# Altium schematic sheet MCU.SchDoc
size A3; SheetNumber: 2; SheetTotal: 6
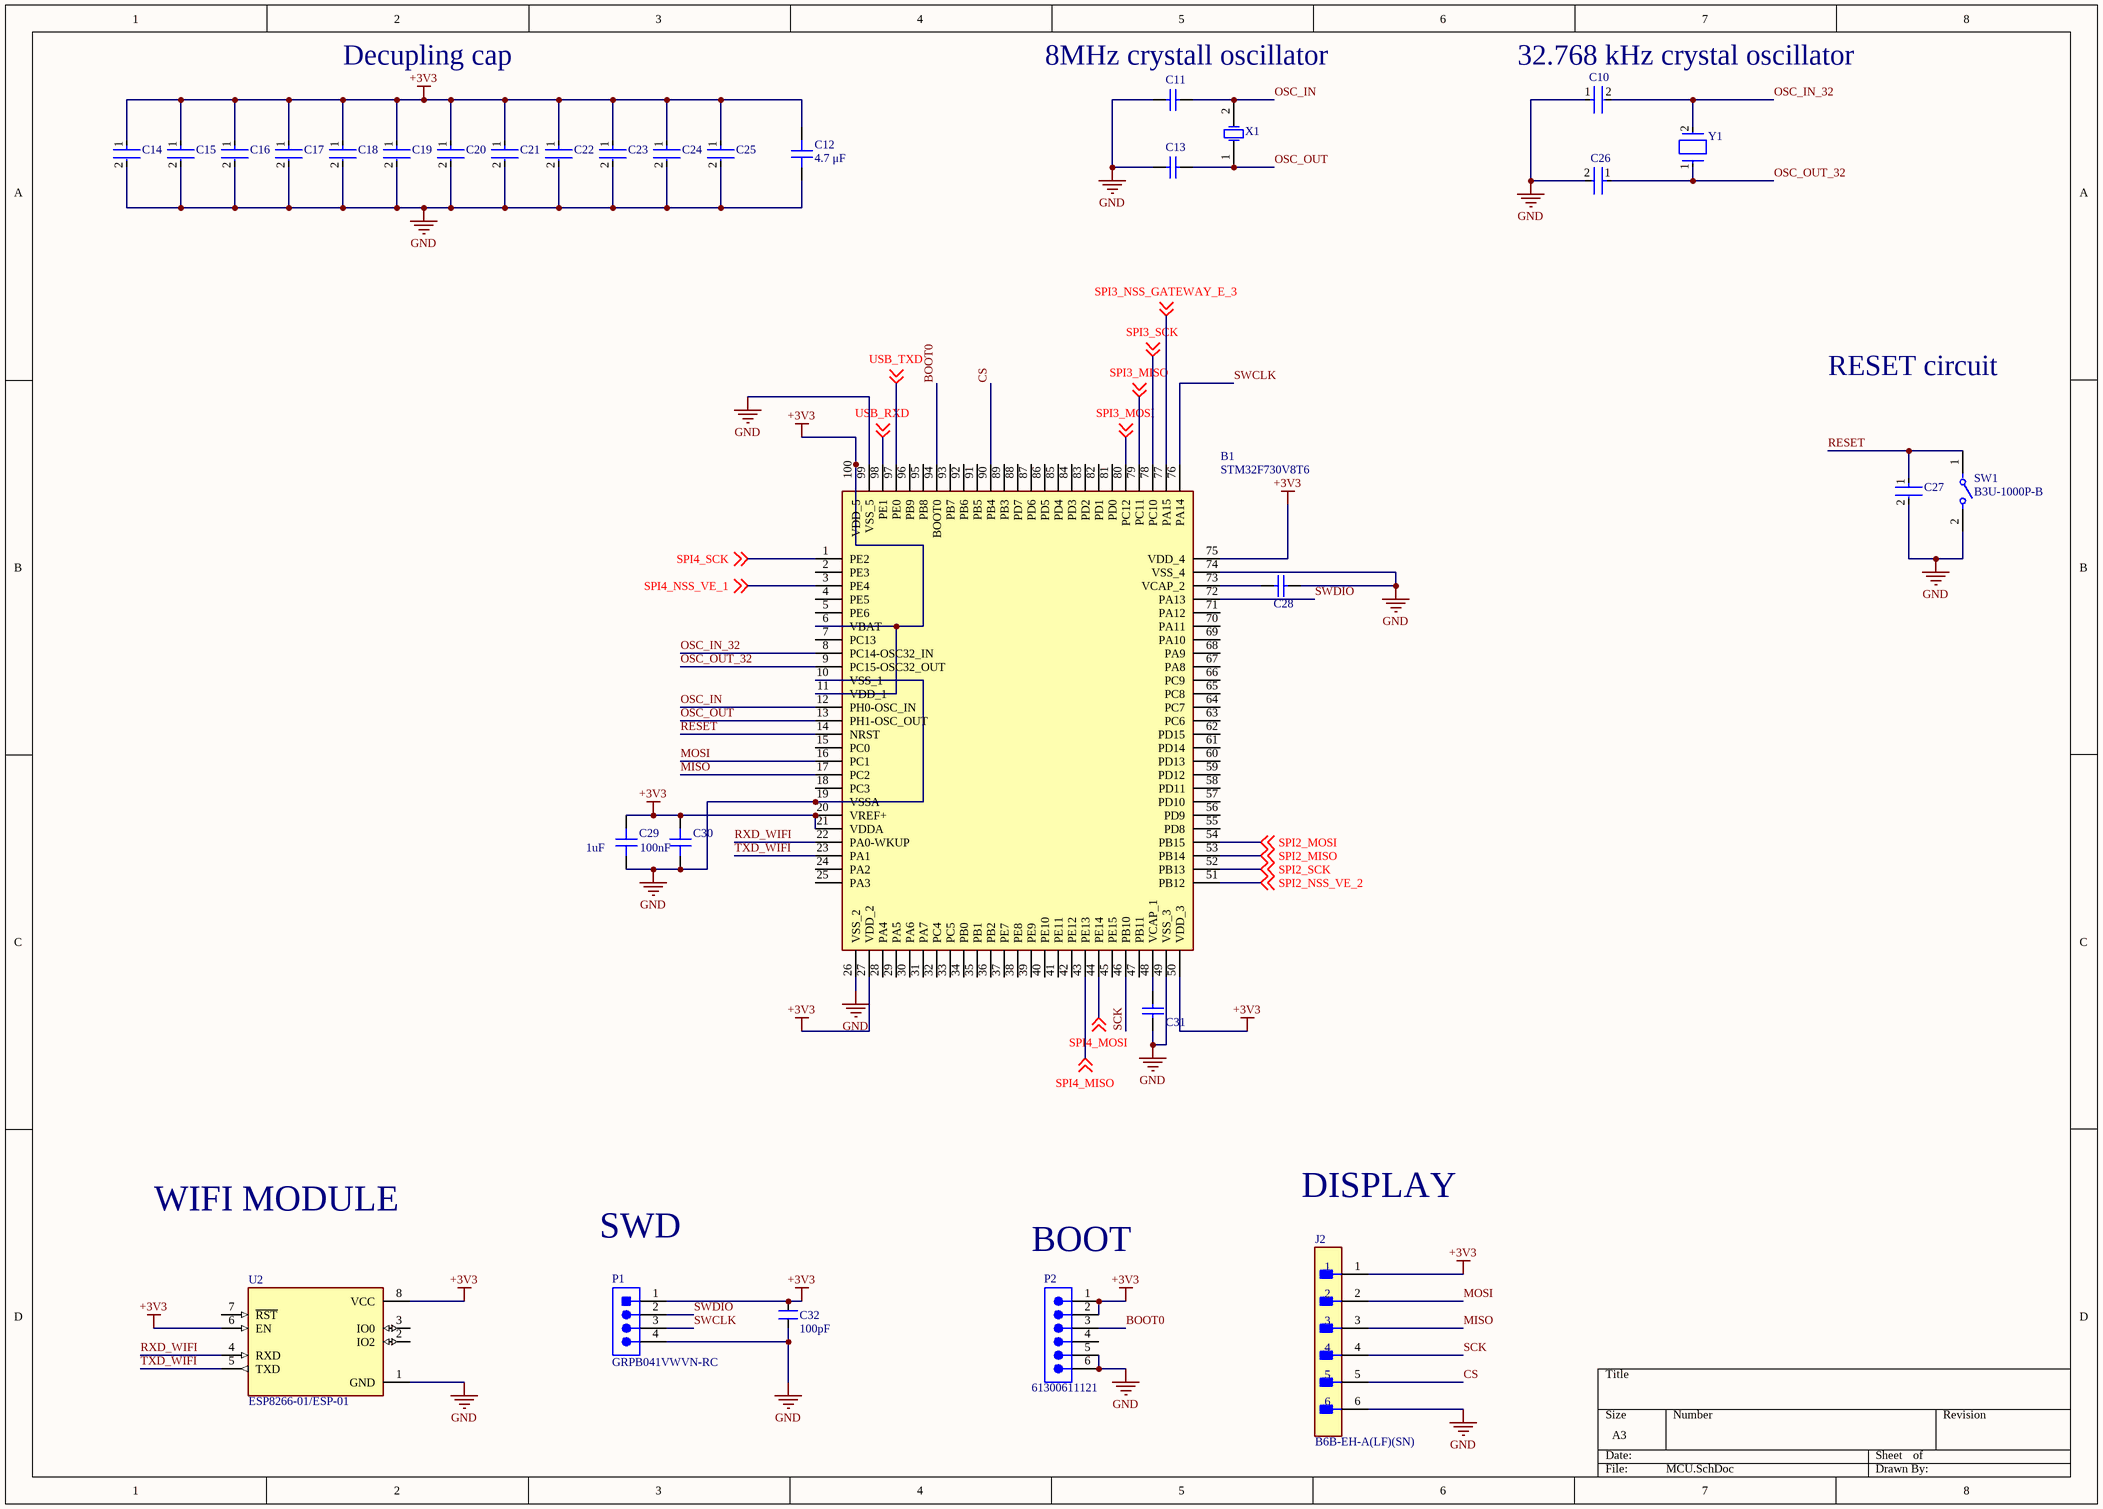
[diagram p0: MCU.SchDoc]

## Parts
B1  STM32F730V8T6  [QFP50P1600X1600X160-100N]
C10  C1005C0G1H070D050BA  [FP-C1005-050-0_05-IPC_A]  (value not drawn)
C11  CC0603JRNPO9BN180  [CAPC1608X90X40LL10T20]  (value not drawn)
C12  4.7 μF  [CAP 0402_1005]
C13  CC0603JRNPO9BN180  [CAPC1608X90X40LL10T20]  (value not drawn)
C14  GRM155R71H104KE14D  [FP-GRM155-0_05-IPC_B]  (value not drawn)
C15  GRM155R71H104KE14D  [FP-GRM155-0_05-IPC_B]  (value not drawn)
C16  GRM155R71H104KE14D  [FP-GRM155-0_05-IPC_B]  (value not drawn)
C17  GRM155R71H104KE14D  [FP-GRM155-0_05-IPC_B]  (value not drawn)
C18  GRM155R71H104KE14D  [FP-GRM155-0_05-IPC_B]  (value not drawn)
C19  GRM155R71H104KE14D  [FP-GRM155-0_05-IPC_B]  (value not drawn)
C20  GRM155R71H104KE14D  [FP-GRM155-0_05-IPC_B]  (value not drawn)
C21  GRM155R71H104KE14D  [FP-GRM155-0_05-IPC_B]  (value not drawn)
C22  GRM155R71H104KE14D  [FP-GRM155-0_05-IPC_B]  (value not drawn)
C23  GRM155R71H104KE14D  [FP-GRM155-0_05-IPC_B]  (value not drawn)
C24  GRM155R71H104KE14D  [FP-GRM155-0_05-IPC_B]  (value not drawn)
C25  GRM155R71H104KE14D  [FP-GRM155-0_05-IPC_B]  (value not drawn)
C26  C1005C0G1H070D050BA  [FP-C1005-050-0_05-IPC_A]  (value not drawn)
C27  GRM155R71H104KE14D  [FP-GRM155-0_05-IPC_B]  (value not drawn)
C28  C0603C225K9PACTU  [CAPC1608X90X35LL15T15]  (value not drawn)
C29  1uF  [CAP 0402_1005]
C30  100nF  [CAP 0402_1005]
C31  C0603C225K9PACTU  [CAPC1608X90X35LL15T15]  (value not drawn)
C32  100pF  [CAP_0805]
J2  B6B-EH-A(LF)(SN)  [FP-B6B-EH-A_LF_SN-MFG]
P1  GRPB041VWVN-RC  [SLIN-GRPB041VWVN-RC_V]
P2  61300611121  [61300611121]
SW1  B3U-1000P-B  [FP-B3U-1000P-B-MFG]
U2  ESP8266-01/ESP-01  [XCVR_ESP8266-01/ESP-01]
X1  ECS-80-18-5PX-TR  [ECS-80-18-5PX-TR_V]  (value not drawn)
Y1  ABS07-32.768KHZ-7-T  [FP-ABS07-MFG]  (value not drawn)

## Nets
+3V3: B1.6(VBAT) B1.11(VDD_1) B1.20(VREF+) B1.21(VDDA) B1.27(VDD_2) B1.50(VDD_3) B1.75(VDD_4) B1.100(VDD_5) C12.2 C14.1 C15.1 C16.1 C17.1 C18.1 C19.1 C20.1 C21.1 C22.1 C23.1 C24.1 C25.1 C29.2 C30.2 C32.2 J2.1 P1.1 P2.1 P2.2 U2.6(EN) U2.8(VCC)
GND: B1.10(VSS_1) B1.19(VSSA) B1.26(VSS_2) B1.49(VSS_3) B1.74(VSS_4) B1.99(VSS_5) C10.1 C11.2 C12.1 C13.2 C14.2 C15.2 C16.2 C17.2 C18.2 C19.2 C20.2 C21.2 C22.2 C23.2 C24.2 C25.2 C26.2 C27.2 C28.1 C29.1 C30.1 C31.1 C32.1 J2.6 P1.4 P2.5 P2.6 SW1.2 U2.1(GND)
BOOT0: B1.94(BOOT0) P2.3
CS: B1.90(PB4) J2.5
MISO: B1.17(PC2) J2.3
MOSI: B1.16(PC1) J2.2
OSC_IN: B1.12(PH0-OSC_IN) C11.1 X1.2(X2)
OSC_IN_32: B1.8(PC14-OSC32_IN) C10.2 Y1.2
OSC_OUT: B1.13(PH1-OSC_OUT) C13.1 X1.1(X1)
OSC_OUT_32: B1.9(PC15-OSC32_OUT) C26.1 Y1.1
RESET: B1.14(NRST) C27.1 SW1.1
RXD_WIFI: B1.22(PA0-WKUP) U2.4(RXD)
SCK: B1.46(PB10) J2.4
SPI2_MISO: B1.53(PB14) ; off-sheet SPI2_MISO
SPI2_MOSI: B1.54(PB15) ; off-sheet SPI2_MOSI
SPI2_NSS_VE_2: B1.51(PB12) ; off-sheet SPI2_NSS_VE_2
SPI2_SCK: B1.52(PB13) ; off-sheet SPI2_SCK
SPI3_MISO: B1.79(PC11) ; off-sheet SPI3_MISO
SPI3_MOSI: B1.80(PC12) ; off-sheet SPI3_MOSI
SPI3_NSS_GATEWAY_E_3: B1.77(PA15) ; off-sheet SPI3_NSS_GATEWAY_E_3
SPI3_SCK: B1.78(PC10) ; off-sheet SPI3_SCK
SPI4_MISO: B1.43(PE13) ; off-sheet SPI4_MISO
SPI4_MOSI: B1.44(PE14) ; off-sheet SPI4_MOSI
SPI4_NSS_VE_1: B1.3(PE4) ; off-sheet SPI4_NSS_VE_1
SPI4_SCK: B1.1(PE2) ; off-sheet SPI4_SCK
SWCLK: B1.76(PA14) P1.3
SWDIO: B1.72(PA13) P1.2
TXD_WIFI: B1.23(PA1) U2.5(TXD)
USB_RXD: B1.98(PE1) ; off-sheet USB_RXD
USB_TXD: B1.97(PE0) ; off-sheet USB_TXD
NetB1_48: B1.48(VCAP_1) C31.2
NetB1_73: B1.73(VCAP_2) C28.2

Not connected (* = marked no-connect by the designer): B1 2(PE3) 4(PE5) 5(PE6) 7(PC13) 15(PC0) 18(PC3) 24(PA2) 25(PA3) 28(PA4) 29(PA5) 30(PA6) 31(PA7) 32(PC4) 33(PC5) 34(PB0) 35(PB1) 36(PB2) 37(PE7) 38(PE8) 39(PE9) 40(PE10) 41(PE11) 42(PE12) 45(PE15) 47(PB11) 55(PD8) 56(PD9) 57(PD10) 58(PD11) 59(PD12) 60(PD13) 61(PD14) 62(PD15) 63(PC6) 64(PC7) 65(PC8) 66(PC9) 67(PA8) 68(PA9) 69(PA10) 70(PA11) 71(PA12) 81(PD0) 82(PD1) 83(PD2) 84(PD3) 85(PD4) 86(PD5) 87(PD6) 88(PD7) 89(PB3) 91(PB5) 92(PB6) 93(PB7) 95(PB8) 96(PB9); P2 4; U2 2(IO2) 3(IO0) 7(~{RST})

## Notes on the sheet
- Decupling cap
- (near C11) 8MHz crystall oscillator
- (near C10) 32.768 kHz crystal oscillator
- RESET circuit
- WIFI MODULE
- SWD
- (near P2) BOOT
- DISPLAY

## Library data of the parts
B1 = STM32F730V8T6: STMICROELECTRONICS - STM32F730V8T6 - MCU, 32BIT, 216MHZ, LQFP-100; Geometry.Height: 1.6mm; Manufacturer_Name: STMicroelectronics; Manufacturer_Part_Number: STM32F730V8T6; Mouser Part Number: 511-STM32F730V8T6; Mouser Price/Stock: https://www.mouser.co.uk/ProductDetail/STMicroelectronics/STM32F730V8T6?qs=%252BEew9%252B0nqrCl2wqvNLr5sw%3D%3D; Arrow Part Number: STM32F730V8T6; Arrow Price/Stock: https://www.arrow.com/en/products/stm32f730v8t6/stmicroelectronics; Datasheet Link: https://www.st.com/resource/en/datasheet/stm32f730v8.pdf
C10 C26 = CMP-08246-005328-1: Multilayer Ceramic Capacitors 7pF ±0.5pF 50V C0G SMD 0402; Voltage Rating: 50V; Max Operating Temperature: 125°C; Case/Package: 0402; Case Code (Imperial): 0402; Dielectric: C0G; Min Operating Temperature: -55°C; REACH SVHC: No SVHC; Depth: 0.5mm; RoHS Compliant: Yes; Packaging: Cut Tape; Weight: 2.3E-05oz; Capacitance: 7pF; Package Quantity: 1; Case Code (Metric): 1005; Termination: SMD/SMT; Thickness: 0.022inch; Series: C; Length: 1mm; Voltage Rating (DC): 50V; Width: 0.02inch; Construction: Flat; Lead Free: Lead Free; Mount: Surface Mount; Radiation Hardening: No; Dielectric Material: Ceramic; Height: 0.5mm; Number of Pins: 2
C11 C13 = CMP-1659-00030-1: Chip Capacitor, 18 pF, +/- 5%, 50 V, -55 to 125 degC, 0603 (1608 Metric), RoHS, Tape and Reel; Voltage Rating: 50 V; Case\Package: 0603; Power Rating: 100 mW; Resistance: 68.1 Ohm; Tolerance: 1%; Case Code (Metric): 1608; Max Operating Temperature: 155 degC; RoHSCompliant: true; Case Code (Imperial): 0603; ComponentLink2Description: Datasheet; Package Quantity: 200; PackageReference: 0603; ComponentLink2URL: http://www.yageo.com/NewPortal/yageodocoutput?fileName=/pdf/MLCC/UPY-GP_NP0_16V-to-50V_14.pdf; Length: 1.6 mm; DatasheetVersion: Rev. 14, 07/2016; Min Operating Temperature: -55 degC; ComponentLink1URL: http://www.yageo.com/; Width: 0.8 mm; ComponentLink1Description: Manufacturer URL; Height: 0.45 mm; Radiation Hardening: No; PackageDescription: 2-Pin Surface Mount Device, Body 1.6 x 0.8 mm; Packaging: Tape and Reel
C12 C29 = Cap 0402: SMT Capacitor; VALUE: 100nF
C14-C25 C27 = CMP-2008-04639-2: Chip Multilayer Ceramic Capacitors for General Purpose, 0402, 0.10uF, X7R, 15%, 10%, 50V; Dissipation Factor: 0.025%; Capacitance: 100nF; Weight: 0.000212oz; Thickness: 0.022inch; Voltage Rating (DC): 50V; Dielectric Material: Ceramic; Termination: SMD/SMT; Case/Package: 0402; Case Code (Imperial): 0402; Mount: Surface Mount; REACH SVHC: No SVHC; Resistor Type: Ceramic; Dielectric: X7R; Max Operating Temperature: 125°C; Voltage: 50V; Lead Free: Lead Free; Package Quantity: 10000; Packaging: Tape and Reel; Length: 1mm; Material: Ceramic; Height: 0.5mm; Depth: 0.5mm; Width: 0.5mm; Min Operating Temperature: -55°C; Tolerance: 10%; Case Code (Metric): 1005; Voltage Rating: 50V
C28 C31 = CMP-2006-02260-1: Manufacturer: Kemet; Part Number: C0603C225K9PACTU
C30 = Cap 0402: SMT Capacitor; VALUE: 100nF
C32 = CAP_100pF-100V-5%-0805: 100pF ±5% 100V Ceramic Capacitor C0G, NP0 0805 (2012 Metric); Manufacturer: Murata; Manufacturer Part Number: CL21C101JC61PNC; Alternate Part Number-1: NA; Case/Package: 0805; Supplier-1: SIRICOM; Supplier Part Number-1: 0805N101J101CT
J2 = CMP-17439-000293-1: CONN HEADER VERT 6POS 2.5MM; Voltage Rating: 250V; Number of Positions: 6; Current Rating: 3A; Mated Stacking Heights: 8.1mm; Gender: Male; Insulation Material: Nylon; Number of Contacts: 6; Contact Plating: Tin; Pitch: 2.5mm; Orientation: Straight; Insulation Color: Natural; Packaging: Bulk; Termination: Solder; Flammability Rating: UL94 V-0; Lead Free: Lead Free; Contact Mating Length: 0.13inch; Color: Natural; Contact Finish - Mating: TIN; Connector Type: Header; Contact Shape: Square; Contact Type: Male Pin; Series: EH; Contact Material: Brass; Fastening Type: Friction; Number of Rows: 1; Mount: Through Hole; Housing Color: White
P1 = CMP-2000-06373-1: Male Header, Pitch 1.27 mm, 1 x 4 Position, Height 4 mm, Tail Length 2.3 mm, -40 to 105 degC, RoHS, Bulk; Manufacturer: Sullins; Mating Products: S9010E-04-ND / -CONNHEADER.050"4POSR/APCB / S9008E-04-ND / -CONNHEADER.050"4POSPCBGOLD / S9005E-04-ND / -CONNHEADER.050"4POSSMDGOLD; Other Names: S9014E-04; Dynamic Catalog: GRPB; Pitch: 0.050"(1.27mm); Number of Positions Loaded: All; Number of Positions: 4; Catalog Drawings: S9014ESeriesTop; Connector Type: Header,Unshrouded; Contact Finish Thickness: Flash; Number of Rows: 1; Contact Type: MalePin; Category: Connectors,Interconnects; Contact Mating Length: 0.118"(3.00mm); Family: RectangularConnectors-Headers,MalePins; Datasheet Version: Rev. C, 12/2008; Contact Finish: Gold; Termination: Solder; Manufacturer URL: http://www.sullinscorp.com/; Mounting Type: ThroughHole; Packaging: Bulk; Package Reference: GRPB041VWVN-RC; Datasheet URL: http://www.sullinscorp.com/drawings/71_GRPB___1VWVN-RC,_10957-C.pdf; Mounting Technology: ThroughHole; Package Description: Male Header, Pitch 1.27 mm, 1 x 4 Position, Height 4 mm, Tail Length 2.3 mm; Standard Package: 1
P2 = CMP-1502-01070-2: NexarPartId: 20084590; Operating Supply Voltage: 250V; Current Rating: 3A; Number of Contacts: 6; Gender: Male; Connector Type: Male Pin; Pitch: 2.54mm; Contact Resistance: 20mΩ; Lead Free: Lead Free; REACH SVHC: Unknown; Number of Rows: 1; Color: Black; Min Operating Temperature: -40°C; Contact Material: Copper; Lead Pitch: 2.54mm; Contact Plating: Gold; Number of Pins: 6; Height: 8.89mm; Orientation: Vertical; Termination: Through Hole; Mount: Through Hole; RoHS: Compliant; Contact Gender: Male; Contact Mating Length: 5.9944mm; Voltage Rating: 250V; Number of Positions: 6; Housing Material: PBT; Packaging: Bulk; Max Operating Temperature: 105°C
SW1 = CMP-08834-000005-1: SWITCH TACTILE SPST-NO 0.05A 12V; Manufacturer: Omron; Operating Force: 1.5N; Contact Current Rating: 50mA; Contact Resistance: 100mΩ; Electromechanical Life: 200000Cycles; Height: 1.75mm; Device Class L2: Switches; Temperature Range High: +70°C; Digikey Description: SWITCH TACTILE SPST-NO 0.05A 12V; Throw Configuration: SPST-NO; Ambient Temperature Range High: +70°C; Temperature: -25°C to +70°C; Lead Free: Yes; ComponentLink2URL: https://omronfs.omron.com/en_US/ecb/products/pdf/en-b3u.pdf; Device Class L3: Tactile Switches; Manufacturer Part Number: B3U-1000P-B; Ambient Temperature Range Low: -25°C; Mount: Surface Mount; Automotive: No; Mouser Description: Tactile Switches Top Actuated with boss w/o ground; Octopart: https://octopart.com/b3u-1000p-b-omron-1057356; RoHS: TRUE; Package: 0; Device Class L1: Electromechanical; Voltage Rating Dc: 12V; Category: Switch; Temperature Range Low: -25°C; ComponentLink2Description: Datasheet
U2 = ESP8266-01/ESP-01: MakerFocus 4pcs ESP8266 ESP-01 Serial Wireless WiFi Transceiver Receiver Module 1MB SPI Flash DC3.0-3.6V Internet of Things WiFi Module Board Compatible with Ar duino; Value: *; MP: ESP8266-01/ESP-01; Package: None; Availability: Unavailable; Price: None
X1 = CMP-2000-06193-1: Low Profile Quartz Crystal, 8.0 MHz, 2-Pin SMD, RoHS, Tape and Reel; Brand: ECS; Tolerance: 30PPM; Case Height: 4.3mm; Frequency: 8MHz; Frequency Stability: 50PPM; Case Length: 13.2mm; Case Width: 4.8mm; Load Capacitance: 18pF; Termination Style: SMD/SMT; Product Category: Crystals; Packaging: Reel; Package Reference: ECS-80-18-5PX-TR; Mounting Technology: SurfaceMount; Dimensions: 4.8mmWx13.2mmLx4.3mmH; Package Description: 2-Pin Surface Mount Device, Body 11.4 x 4.8 mm, Height 4.3 mm; Datasheet URL: https://www.ecsxtal.com/store/pdf/csm-7x.pdf; Datasheet Version: 05/2016; Manufacturer: ECS; Factory Pack Quantity: 1000; Manufacturer URL: https://www.ecsxtal.com/; Type: SMDQuartzCrystals; Mounting Style: SMD/SMT; Package / Case: HC-49/US; Operating Temperature Range: -10Cto+70C; RoHS: Details; Series: CSM-7X
Y1 = CMP-27762-014373-1: Crystal 32.768kHz ±20ppm (Tol) 7pF FUND 70kΩ 2-Pin CSMD T/R; Insulation Resistance: 500MR; Series Resistance: 70kR; Mount: Surface Mount; Tolerance: 20ppm; Length: 3.2mm; Lead Free: Lead Free; Frequency: 32.768kHz; Frequency Tolerance: 20ppm; Frequency Stability: 20ppm; Load Capacitance: 7pF; Radiation Hardening: No; Package Quantity: 3000; Width: 1.5mm; Height: 0.9mm; Termination: SMD/SMT; Max Operating Temperature: 85°C; Number of Pins: 2; Operating Frequency: 32.768 kHz; ESR (Equivalent Series Resistance): 70kR; Packaging: Tape and Reel; Series: ABS07; Min Operating Temperature: -40°C; Depth: 1.5mm; Case/Package: CSMD